# EAGLE schematic modbus (EAGLE 9.5.1)
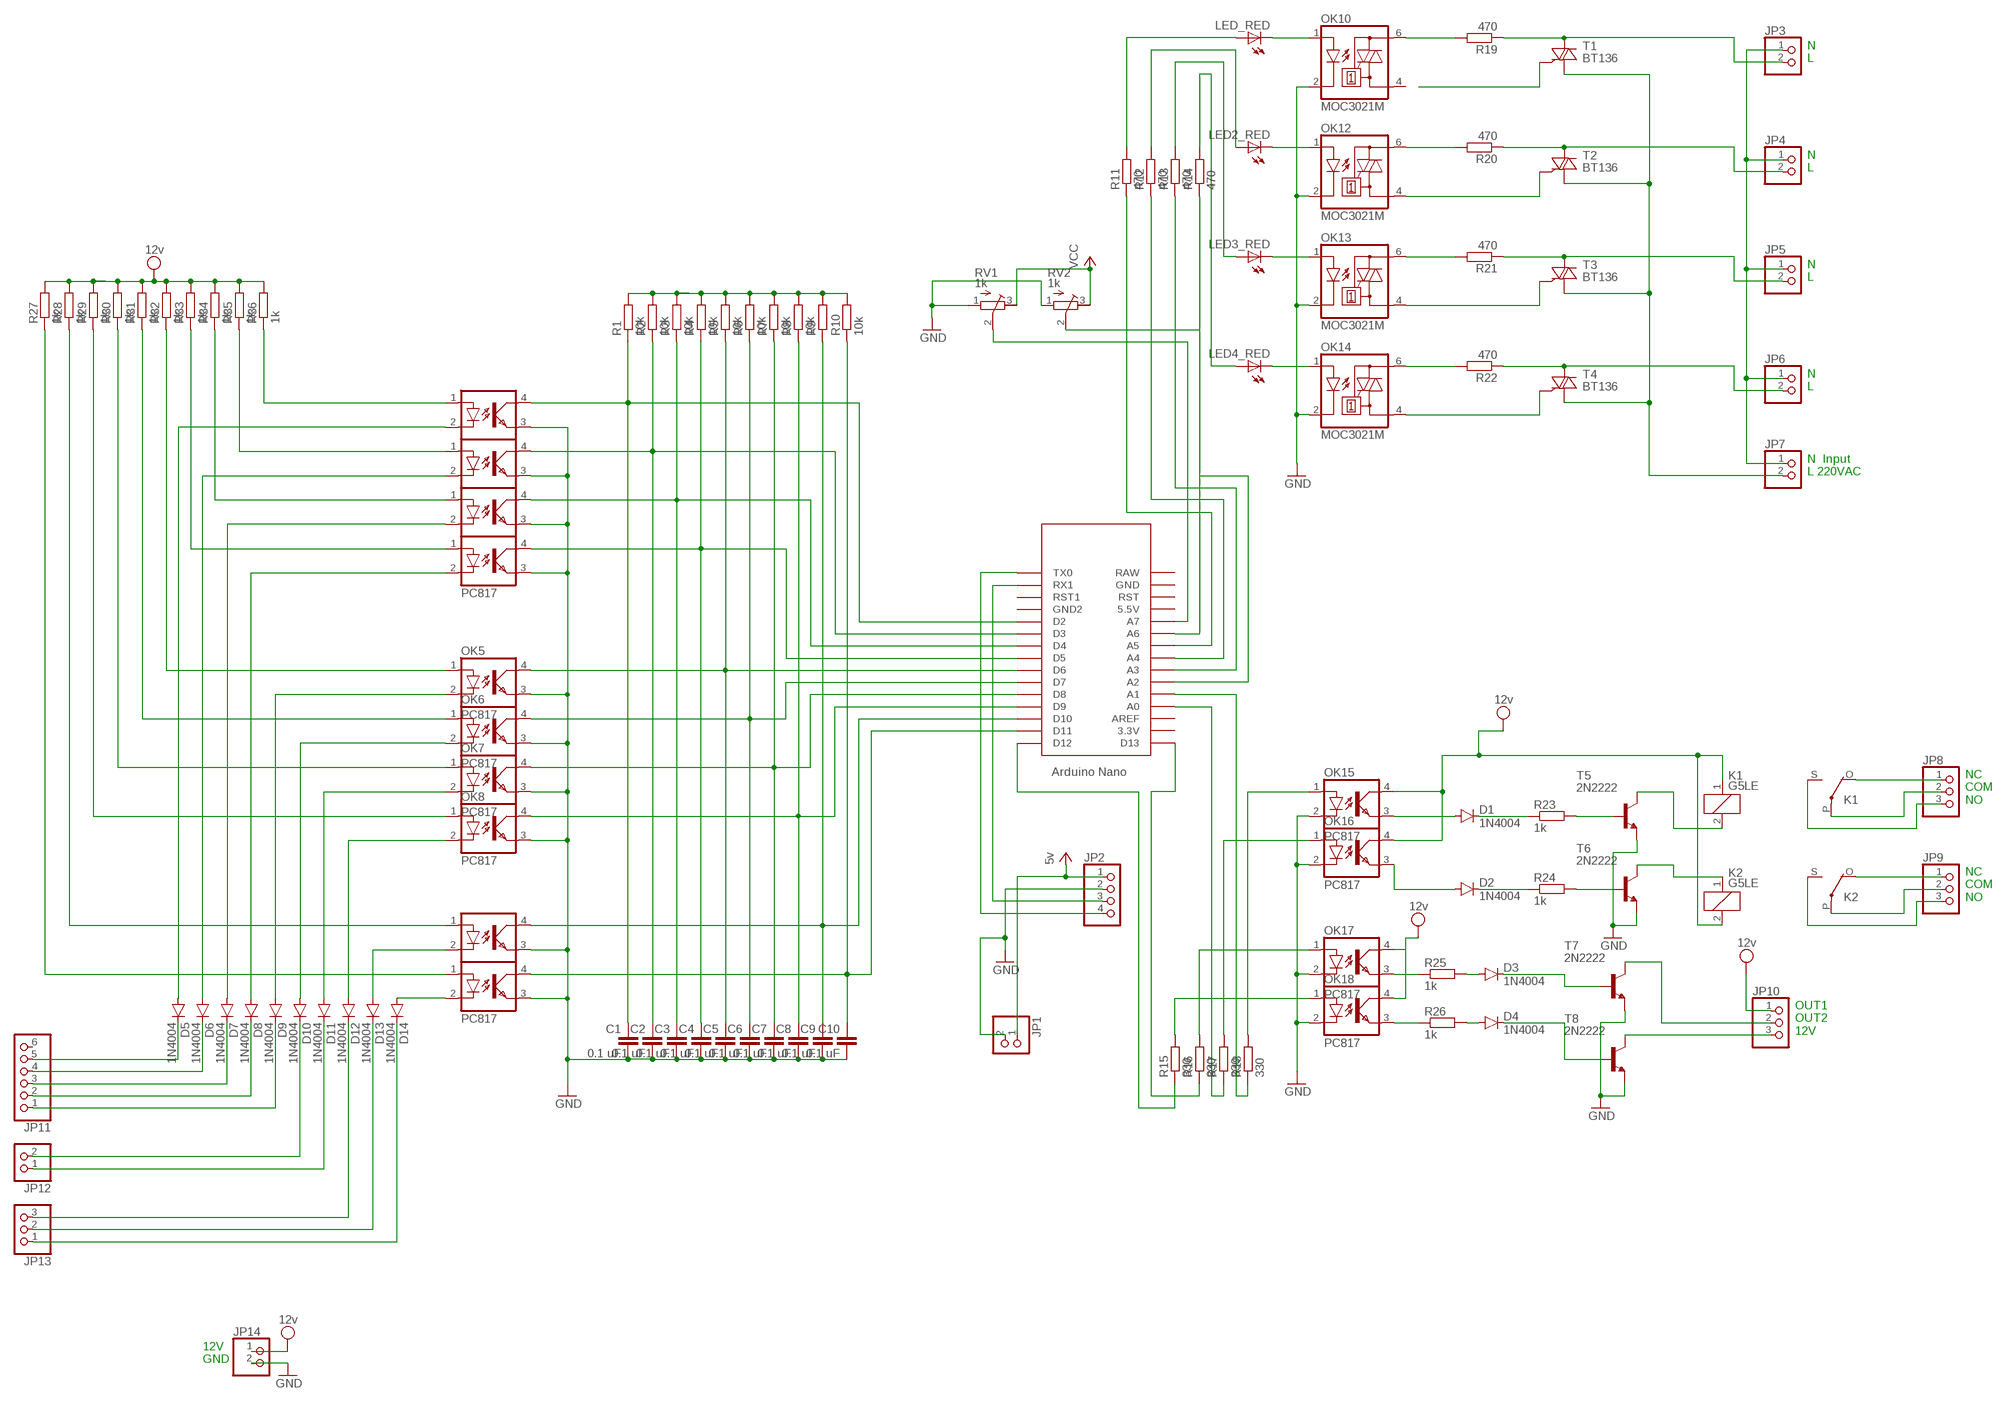
[diagram p0: schematic, sheet 1]

## Parts
C1  0.1 uF  C-EU025-025X050  [C025-025X050]
C2  0.1 uF  C-EU025-025X050  [C025-025X050]
C3  0.1 uF  C-EU025-025X050  [C025-025X050]
C4  0.1 uF  C-EU025-025X050  [C025-025X050]
C5  0.1 uF  C-EU025-025X050  [C025-025X050]
C6  0.1 uF  C-EU025-025X050  [C025-025X050]
C7  0.1 uF  C-EU025-025X050  [C025-025X050]
C8  0.1 uF  C-EU025-025X050  [C025-025X050]
C9  0.1 uF  C-EU025-025X050  [C025-025X050]
C10  0.1 uF  C-EU025-025X050  [C025-025X050]
D1  1N4004  [DO41-10]
D2  1N4004  [DO41-10]
D3  1N4004  [DO41-10]
D4  1N4004  [DO41-10]
D5  1N4004  [DO41-10]
D6  1N4004  [DO41-10]
D7  1N4004  [DO41-10]
D8  1N4004  [DO41-10]
D9  1N4004  [DO41-10]
D10  1N4004  [DO41-10]
D11  1N4004  [DO41-10]
D12  1N4004  [DO41-10]
D13  1N4004  [DO41-10]
D14  1N4004  [DO41-10]
JP1  PINHD-1X2  [1X02]
JP2  PINHD-1X4  [1X04]
JP3  1.N 2.L  PINHD-1X2  [1X02]
JP4  1.N 2.L  PINHD-1X2  [1X02]
JP5  1.N 2.L  PINHD-1X2  [1X02]
JP6  1.N 2. L  PINHD-1X2  [1X02]
JP7  1.N 2.220VAC  PINHD-1X2  [1X02]
JP8  PINHD-1X3  [1X03]
JP9  PINHD-1X3  [1X03]
JP10  PINHD-1X3  [1X03]
JP11  PINHD-1X6  [1X06]
JP12  PINHD-1X2  [1X02]
JP13  PINHD-1X3  [1X03]
JP14  PINHD-1X2  [1X02]
K1  G5LE  [G5LE]
K2  G5LE  [G5LE]
LED2_RED  LED5MM  [LED5MM]
LED3_RED  LED5MM  [LED5MM]
LED4_RED  LED5MM  [LED5MM]
LED_RED  LED5MM  [LED5MM]
OK1  PC817  [DIL04]
OK2  PC817  [DIL04]
OK3  PC817  [DIL04]
OK4  PC817  [DIL04]
OK5  PC817  [DIL04]
OK6  PC817  [DIL04]
OK7  PC817  [DIL04]
OK8  PC817  [DIL04]
OK9  PC817  [DIL04]
OK10  MOC3021M  [DIL06]
OK11  PC817  [DIL04]
OK12  MOC3021M  [DIL06]
OK13  MOC3021M  [DIL06]
OK14  MOC3021M  [DIL06]
OK15  PC817  [DIL04]
OK16  PC817  [DIL04]
OK17  PC817  [DIL04]
OK18  PC817  [DIL04]
R1  10k  R-EU_0207/10  [0207/10]
R2  10k  R-EU_0207/10  [0207/10]
R3  10k  R-EU_0207/10  [0207/10]
R4  10k  R-EU_0207/10  [0207/10]
R5  10k  R-EU_0207/10  [0207/10]
R6  10k  R-EU_0207/10  [0207/10]
R7  10k  R-EU_0207/10  [0207/10]
R8  10k  R-EU_0207/10  [0207/10]
R9  R-EU_0207/10  [0207/10]
R10  10k  R-EU_0207/10  [0207/10]
R11  470  R-EU_0207/10  [0207/10]
R12  470  R-EU_0207/10  [0207/10]
R13  470  R-EU_0207/10  [0207/10]
R14  470  R-EU_0207/10  [0207/10]
R15  330  R-EU_0207/10  [0207/10]
R16  330  R-EU_0207/10  [0207/10]
R17  330  R-EU_0207/10  [0207/10]
R18  330  R-EU_0207/10  [0207/10]
R19  470  R-EU_0207/10  [0207/10]
R20  470  R-EU_0207/10  [0207/10]
R21  470  R-EU_0207/10  [0207/10]
R22  470  R-EU_0207/10  [0207/10]
R23  1k  R-EU_0207/10  [0207/10]
R24  1k  R-EU_0207/10  [0207/10]
R25  1k  R-EU_0207/10  [0207/10]
R26  1k  R-EU_0207/10  [0207/10]
R27  1k  R-EU_0207/10  [0207/10]
R28  1k  R-EU_0207/10  [0207/10]
R29  1k  R-EU_0207/10  [0207/10]
R30  1k  R-EU_0207/10  [0207/10]
R31  1k  R-EU_0207/10  [0207/10]
R32  1k  R-EU_0207/10  [0207/10]
R33  1k  R-EU_0207/10  [0207/10]
R34  1k  R-EU_0207/10  [0207/10]
R35  1k  R-EU_0207/10  [0207/10]
R36  1k  R-EU_0207/10  [0207/10]
RV1  1k  R-TRIMM3339P  [RTRIM3339P]
RV2  1k  R-TRIMM3339P  [RTRIM3339P]
T1  BT136  [TO220AB]
T2  BT136  [TO220AB]
T3  BT136  [TO220AB]
T4  BT136  [TO220AB]
T5  2N2222  [TO92-EBC-OVAL]
T6  2N2222  [TO92-EBC-OVAL]
T7  2N2222  [TO92-EBC-OVAL]
T8  2N2222  [TO92-EBC-OVAL]
U$1  NANO  [NANO]

## Nets
GND: C1.2 C2.2 C3.2 C4.2 C5.2 C6.2 C7.2 C8.2 C9.2 C10.2 JP1.2 JP2.2 JP14.2 OK1.3(EMIT) OK2.3(EMIT) OK3.3(EMIT) OK4.3(EMIT) OK5.3(EMIT) OK6.3(EMIT) OK7.3(EMIT) OK8.3(EMIT) OK9.3(EMIT) OK10.2(C) OK11.3(EMIT) OK12.2(C) OK13.2(C) OK14.2(C) OK15.2(C) OK16.2(C) OK17.2(C) OK18.2(C) RV1.1(A) RV2.1(A) T5.E T6.E T7.E T8.E
N$1: JP8.1 K1.O(2:O)
N$2: C1.1 OK1.4(COL) R1.1 U$1.D2
N$3: C2.1 OK2.4(COL) R2.1 U$1.D3
N$4: C3.1 OK3.4(COL) R3.1 U$1.D4
N$5: C4.1 OK4.4(COL) R4.1 U$1.D5
N$6: C5.1 OK5.4(COL) R5.1 U$1.D6
N$7: C6.1 OK6.4(COL) R6.1 U$1.D7
N$8: C7.1 OK7.4(COL) R7.1 U$1.D8
N$9: C8.1 OK8.4(COL) R8.1 U$1.D9
N$10: C9.1 OK9.4(COL) R9.1 U$1.D10
N$11: C10.1 OK11.4(COL) R10.1 U$1.D11
N$12: JP2.3 U$1.RX1
N$13: JP2.4 U$1.TX0
N$14: RV2.2(S) U$1.A6
N$15: RV1.2(S) U$1.A7
N$16: LED_RED.K(C) OK10.1(A)
N$17: LED2_RED.K(C) OK12.1(A)
N$18: LED3_RED.K(C) OK13.1(A)
N$19: LED4_RED.K(C) OK14.1(A)
N$20: LED_RED.A R11.2
N$21: LED2_RED.A R12.2
N$22: LED3_RED.A R13.2
N$23: LED4_RED.A R14.2
N$24: R11.1 U$1.A5
N$25: R12.1 U$1.A4
N$26: R13.1 U$1.A3
N$27: R14.1 U$1.A2
N$28: R17.1 U$1.A0
N$29: R15.1 U$1.D12
N$30: R16.1 U$1.D13
N$31: R18.1 U$1.A1
N$32: OK18.1(A) R15.2
N$33: OK17.1(A) R16.2
N$34: OK16.1(A) R17.2
N$35: OK15.1(A) R18.2
N$36: OK10.6(A2) R19.2
N$37: JP3.2 R19.1 T1.2(A2)
N$38: JP4.2 R20.1 T2.2(A2)
N$39: JP5.2 R21.1 T3.2(A2)
N$40: JP6.2 R22.1 T4.2(A2)
N$41: T1.3(G)
N$42: OK12.4(A1) T2.3(G)
N$43: OK12.6(A2) R20.2
N$44: OK13.6(A2) R21.2
N$45: OK13.4(A1) T3.3(G)
N$46: OK14.4(A1) T4.3(G)
N$47: OK14.6(A2) R22.2
N$48: JP8.2 K1.P(2:P)
N$49: JP7.2 T1.1(A1) T2.1(A1) T3.1(A1) T4.1(A1)
N$50: D1.A OK15.3(EMIT)
N$51: D2.A OK16.3(EMIT)
N$52: D2.C R24.1
N$53: JP3.1 JP4.1 JP5.1 JP6.1 JP7.1
N$54: D1.C R23.1
N$55: R23.2 T5.B
N$56: R24.2 T6.B
N$57: JP8.3 K1.S(2:S)
N$58: K1.2 T5.C
N$59: K2.1 T6.C
N$60: JP9.1 K2.O(2:O)
N$61: JP9.2 K2.P(2:P)
N$62: JP9.3 K2.S(2:S)
N$63: OK18.3(EMIT) R26.1
N$64: OK17.3(EMIT) R25.1
N$65: JP10.1 OK17.4(COL) OK18.4(COL) ; supply symbol labelled 12v
N$66: D3.A R25.2
N$67: D4.A R26.2
N$68: D3.C T7.B
N$69: D4.C T8.B
N$70: JP10.2 T7.C
N$71: JP10.3 T8.C
N$72: OK1.1(A) R36.1
N$73: OK2.1(A) R35.1
N$74: OK3.1(A) R34.1
N$75: OK4.1(A) R33.1
N$76: OK5.1(A) R32.1
N$77: OK6.1(A) R31.1
N$78: OK7.1(A) R30.1
N$79: OK8.1(A) R29.1
N$80: OK9.1(A) R28.1
N$81: OK11.1(A) R27.1
N$82: R1.2 R2.2 R3.2 R4.2 R5.2 R6.2 R7.2 R8.2 R9.2 R10.2
N$83: D5.C JP11.5
N$84: D6.C JP11.4
N$85: D7.C JP11.3
N$86: D8.C JP11.2
N$87: D9.C JP11.1
N$88: D10.C JP12.2
N$89: D11.C JP12.1
N$90: D12.C JP13.3
N$91: D13.C JP13.2
N$92: D14.C JP13.1
N$93: D14.A OK11.2(C)
N$94: D13.A OK9.2(C)
N$95: D12.A OK8.2(C)
N$96: D11.A OK7.2(C)
N$97: D10.A OK6.2(C)
N$98: D9.A OK5.2(C)
N$99: D8.A OK4.2(C)
N$100: D7.A OK3.2(C)
N$101: D6.A OK2.2(C)
N$102: D5.A OK1.2(C)
VCC: JP1.1 JP2.1 JP14.1 K1.1 K2.2 OK15.4(COL) OK16.4(COL) R27.2 R28.2 R29.2 R30.2 R31.2 R32.2 R33.2 R34.2 R35.2 R36.2 RV1.3(E) RV2.3(E) ; supply symbol labelled 5v, 12v
Unconnected: JP11.6 OK10.4(A1) U$1.3.3V U$1.5V(5.5V) U$1.AREF U$1.GND U$1.GND1(GND2) U$1.ICSP1 U$1.ICSP2 U$1.ICSP3 U$1.ICSP4 U$1.ICSP5 U$1.ICSP6 U$1.RAW U$1.RST U$1.RST1

## Notes on the sheet
- N
  L
- N
  L
- N
  L
- N
  L
- N  Input
  L 220VAC
- NC
  COM
  NO
- NC
  COM
  NO
- OUT1
  OUT2
  12V
- 12V
  GND

## Library data of the parts
C1-C10 = rcl:C-EU: CAPACITOR, European symbol; SPICEPREFIX: C
D1-D14 = diode:1N4004: DIODE general purpose rectifier, 1 A
JP1 JP3-JP7 JP12 JP14 = pinhead:PINHD-1X2: PIN HEADER
JP2 = pinhead:PINHD-1X4: PIN HEADER
JP8-JP10 JP13 = pinhead:PINHD-1X3: PIN HEADER
JP11 = pinhead:PINHD-1X6: PIN HEADER
K1 K2 = relay:G5LE: RELAY 1 x switch, 10 A/120 V AC, 8 A/30 V DC, Omron; OC_FARNELL: unknown; OC_NEWARK: unknown
LED2_RED LED3_RED LED4_RED LED_RED = adafruit:LED: LED OSRAM: - CHIPLED LG R971, LG N971, LY N971, LG Q971, LY Q971, LO R971, LY R971 LH N974, LH R974 LS Q976, LO Q976, LY Q976 LO Q996 - Hyper CHIPLED LW Q18S LB Q993, LB Q99A, LB R99A - SideLED LS A670, LO A670, LY A670, LG A670, LP A670 LB A673, LV A673, LT A673, LW A673 LH A674 LY A675 LS A676, LA A676, LO A676, LY A676, LW A676 LS A679, LY A679, LG A679 - Hyper Micro SIDELED® LS Y876, LA Y876, LO Y876, LY Y876 LT Y87S - SmartLED LW L88C, LW L88S LB L89C, LB L89S, LG L890 LS L89K, LO L89K, LY L89K LS L896, LA L896, LO L896, LY L896 - TOPLED LS T670, LO T670, LY T670, LG T670, LP T670 LSG T670, LSP T670, LSY T670, LOP T670, LYG T670 LG T671, LOG T671, LSG T671 LB T673, LV T673, LT T673, LW T673 LH T674 LS T676, LA T676, LO T676, LY T676, LB T676, LH T676, LSB T676, LW T676 LB T67C, LV T67C, LT T67C, LS T67K, LO T67K, LY T67K, LW E67C LS E67B, LA E67B, LO E67B, LY E67B, LB E67C, LV E67C, LT E67C LW T67C LS T679, LY T679, LG T679 LS T770, LO T770, LY T770, LG T770, LP T770 LB T773, LV T773, LT T773, LW T773 LH T774 LS E675, LA E675, LY E675, LS T675 LS T776, LA T776, LO T776, LY T776, LB T776 LHGB T686 LT T68C, LB T68C - Hyper Mini TOPLED® LB M676 - Mini TOPLED Santana® LG M470 LS M47K, LO M47K, LY M47K Source: http://www.osram.convergy.de/
OK1-OK9 OK11 OK15-OK18 = optocoupler:PC817: SHARP OPTO COUPLER; MPN: PC817X4J000F; OC_FARNELL: 9707727; OC_NEWARK: 97K7059
OK10 OK12-OK14 = optocoupler:MOC30*M: RANDOM-PHASE OPTOISOLATORS TRIAC DRIVER OUTPUT Source: http://www.fairchildsemi.com MOC3020-M.pdf; MF: FAIRCHILD SEMICONDUCTOR; MPN: MOC3021-M; OC_FARNELL: 1021365; OC_NEWARK: 95B7895
R1-R36 = rcl:R-EU_: RESISTOR, European symbol; SPICEPREFIX: R
RV1 RV2 = rcl:R-TRIMM: Trimm resistor; SPICEMODEL: X; SPICEPREFIXL: POT
T1-T4 = triac:BT136: Triac BT136 series E sensitive gate Source: http://www.nxp.com/acrobat_download/datasheets/BT136_SERIES_E_2.pdf
T5-T8 = adafruit:2N2222: NPN TRANSISTOR Big oval pads
U$1 = Arduino-clone:NANO: Arduino Nano